# EAGLE schematic schematic wemos-temphum sensor (EAGLE 9.5.1)
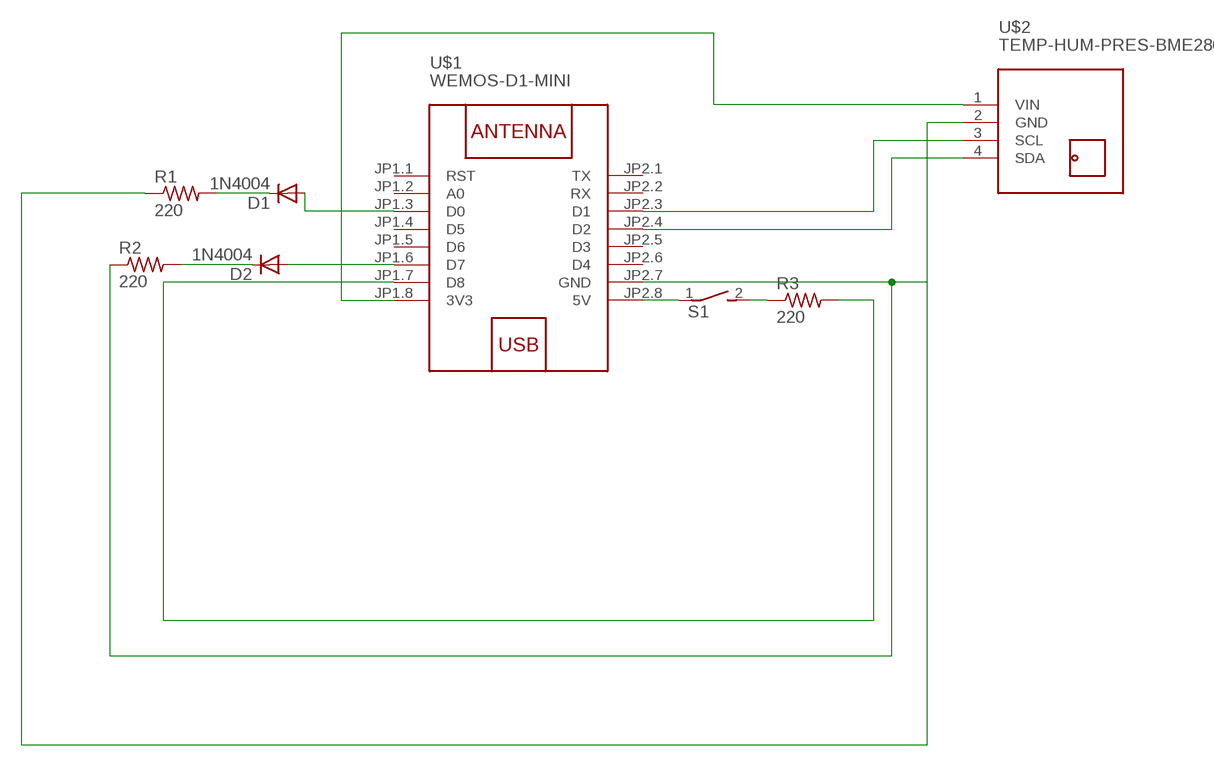
[diagram p0: schematic, sheet 1]

## Parts
D1  1N4004  [DO41-10]
D2  1N4004  [DO41-10]
R1  220  R-US_0207/10  [0207/10]
R2  220  R-US_0207/10  [0207/10]
R3  220  R-US_0207/10  [0207/10]
S1  DS01E  [DS-01]
U$1  WEMOS-D1-MINI  [WEMOS-D1-MINI]
U$2  TEMP-HUM-PRES-BME280  [TEMP-HUM-PRES-BME280]

## Nets
N$1: D1.A U$1.JP1.3(D0)
N$2: D1.C R1.2
N$3: R1.1 R2.1 U$1.JP2.7(GND) U$2.2(GND)
N$4: D2.A U$1.JP1.6(D7)
N$5: D2.C R2.2
N$6: R3.2 U$1.JP1.7(D8)
N$7: R3.1 S1.2
N$8: S1.1 U$1.JP2.8(5V)
N$9: U$1.JP2.4(D2) U$2.4(SDA)
N$10: U$1.JP2.3(D1) U$2.3(SCL)
N$11: U$1.JP1.8(3V3) U$2.1(VIN)
Unconnected: U$1.JP1.1(RST) U$1.JP1.2(A0) U$1.JP1.4(D5) U$1.JP1.5(D6) U$1.JP2.1(TX) U$1.JP2.2(RX) U$1.JP2.5(D3) U$1.JP2.6(D4)

## Library data of the parts
D1 D2 = adafruit:1N4004: DIODE General purpose 1N400x type rectifier (With bigger pads) http://www.ladyada.net/library/pcb/eaglelibrary.html
R1-R3 = rcl:R-US_: RESISTOR, American symbol; SPICEPREFIX: R
S1 = switch-dil:DS01E: DIL/CODE SWITCH; OC_FARNELL: unknown; OC_NEWARK: unknown
U$1 = diy-modules:WEMOS-D1-MINI: WEMOS D1 mini: Mini Wi-Fi Board based on ESP-8266 device More details can be found here: https://www.wemos.cc/product/d1-mini.html Click here to find device on ebay.com <http://www.ebay.com/sch/wemos+d1+mini+nodemcu>
U$2 = diy-modules:TEMP-HUM-PRES-BME280: Digital Humidity-Temperature-Pressure Sensor based on BME280 device More information about BME280 device is available here: https://www.bosch-sensortec.com/bst/products/all_products/bme280 Click here to find device on ebay.com <http://www.ebay.com/sch/bme280+breakout>